# Altium schematic sheet MCU.SchDoc
size A3; SheetNumber: 2; SheetTotal: 10
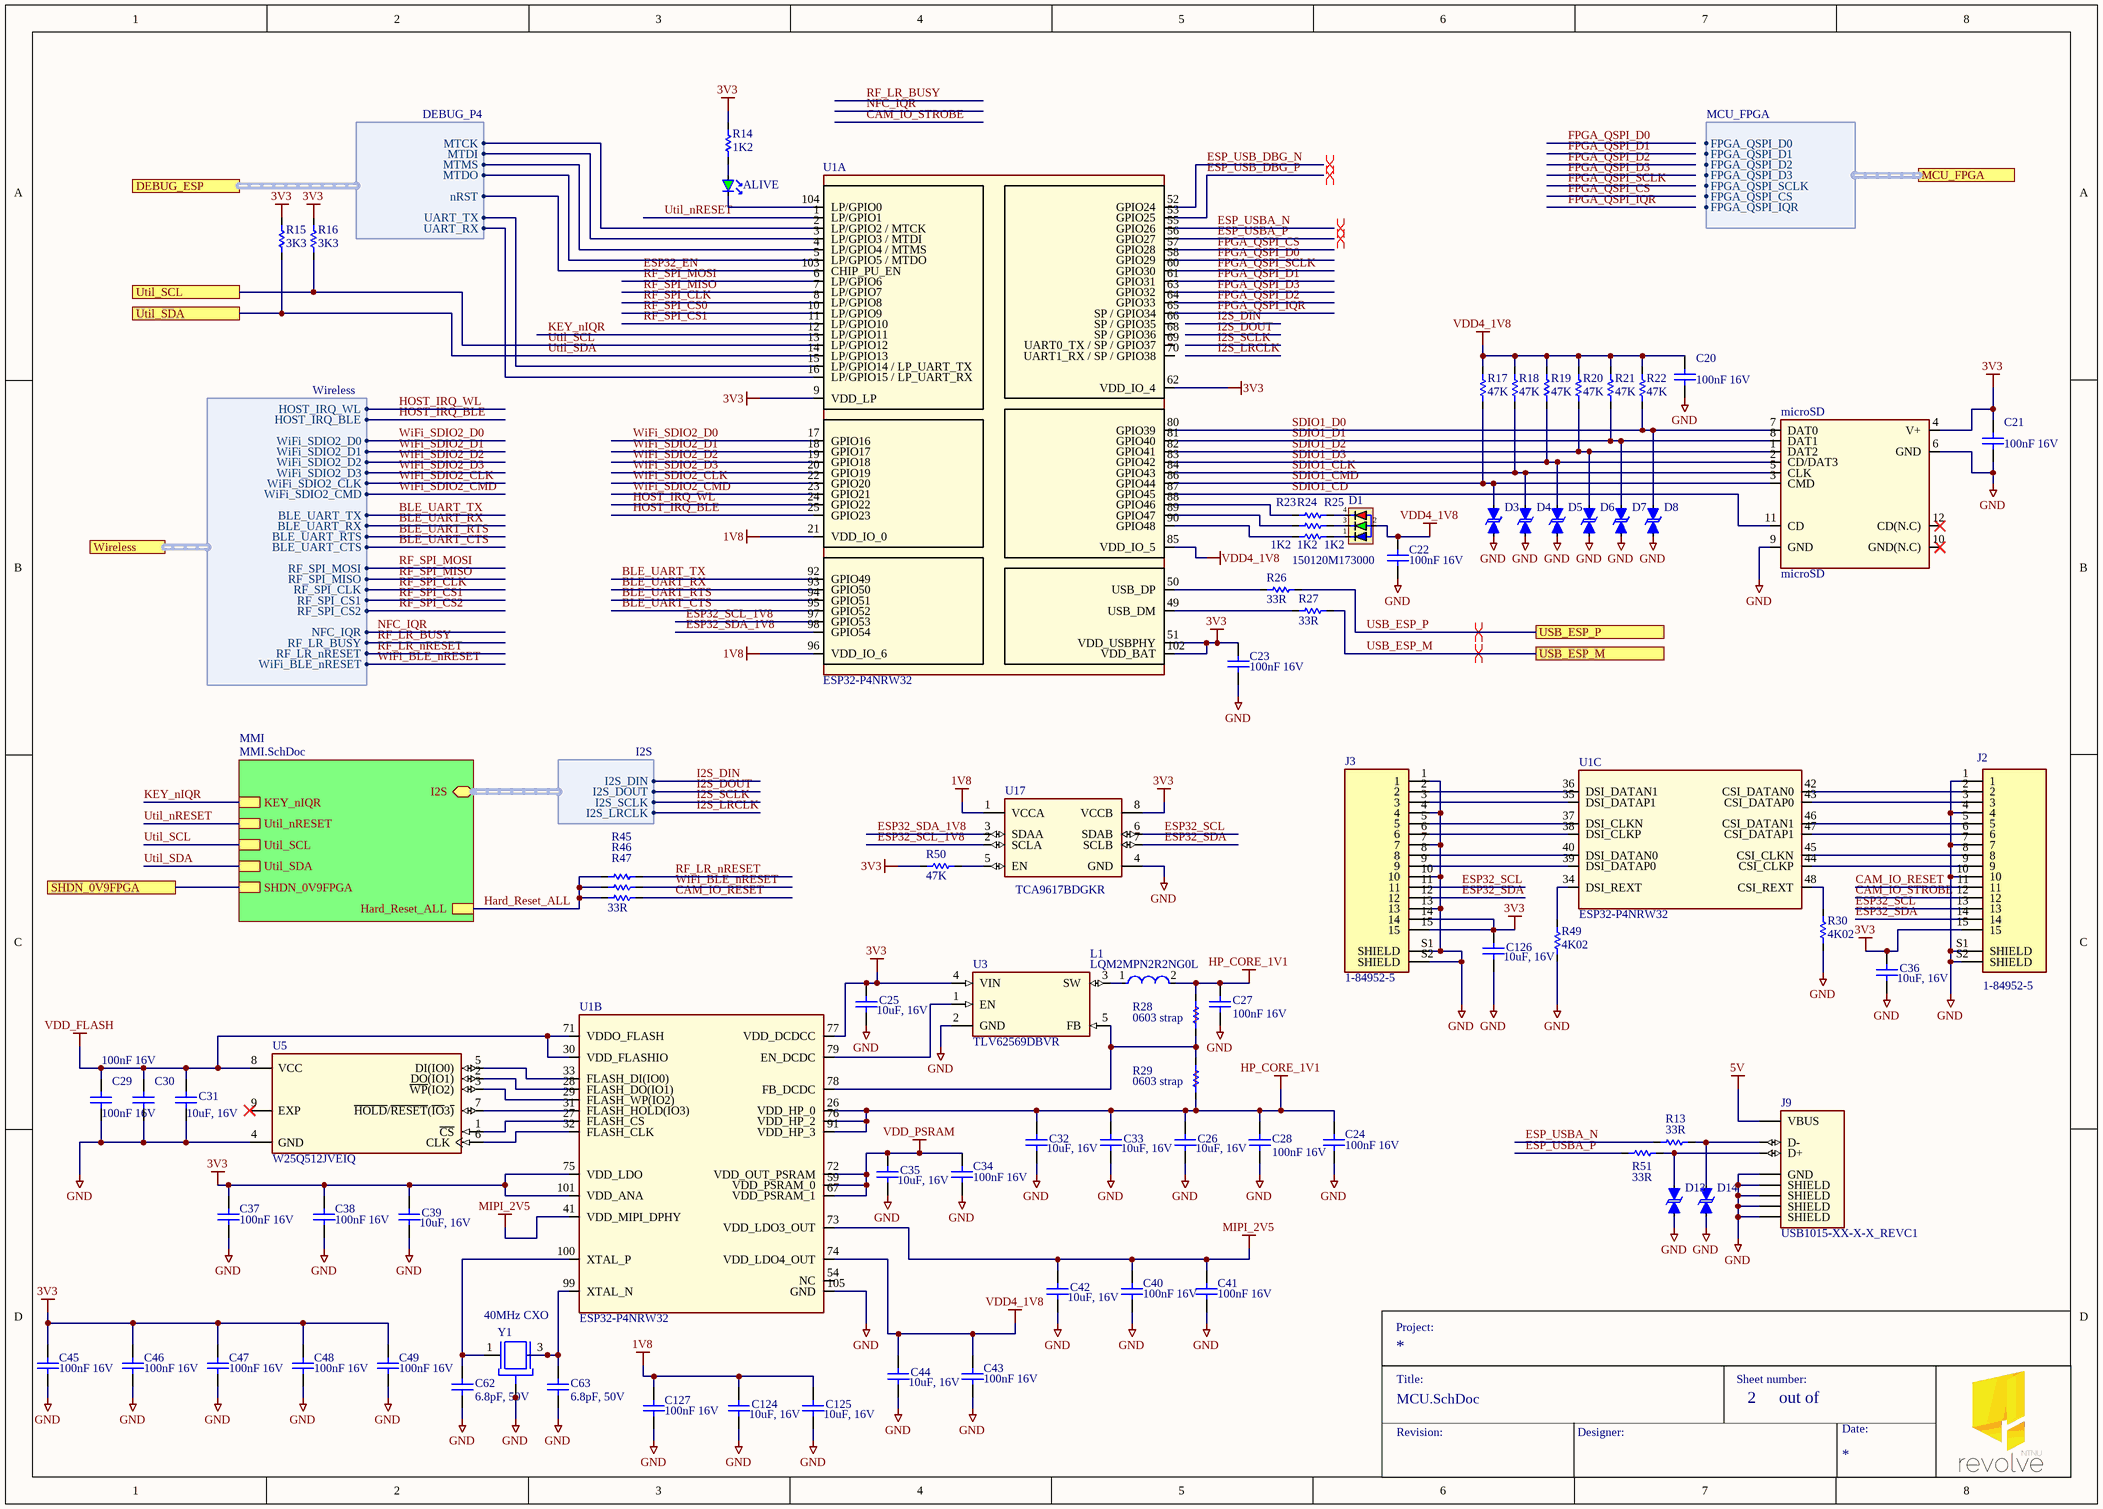
[diagram p0: MCU.SchDoc]

## Parts
ALIVE  SMD LED 0603, Green  [LED-0603-RED]  (value not drawn)
C20  100nF 16V  [0402]
C21  100nF 16V  [0402]
C22  100nF 16V  [0402]
C23  100nF 16V  [0402]
C24  100nF 16V  [0402]
C25  10uF, 16V  [0603 Capacitor]
C26  10uF, 16V  [0603 Capacitor]
C27  100nF 16V  [0402]
C28  100nF 16V  [0402]
C29  100nF 16V  [0402]
C30  100nF 16V  [0402]
C31  10uF, 16V  [0603 Capacitor]
C32  10uF, 16V  [0603 Capacitor]
C33  10uF, 16V  [0603 Capacitor]
C34  100nF 16V  [0402]
C35  10uF, 16V  [0603 Capacitor]
C36  10uF, 16V  [0603 Capacitor]
C37  100nF 16V  [0402]
C38  100nF 16V  [0402]
C39  10uF, 16V  [0603 Capacitor]
C40  100nF 16V  [0402]
C41  100nF 16V  [0402]
C42  10uF, 16V  [0603 Capacitor]
C43  100nF 16V  [0402]
C44  10uF, 16V  [0603 Capacitor]
C45  100nF 16V  [0402]
C46  100nF 16V  [0402]
C47  100nF 16V  [0402]
C48  100nF 16V  [0402]
C49  100nF 16V  [0402]
C62  6.8pF, 50V  [0402 resistor]
C63  6.8pF, 50V  [0402 resistor]
C124  10uF, 16V  [0603 Capacitor]
C125  10uF, 16V  [0603 Capacitor]
C126  10uF, 16V  [0603 Capacitor]
C127  100nF 16V  [0402]
D1  150120M173000  [WL-SFCW_1206]
D3  DESD3V3E1BL-7B  [CR_X1-DFN1006-2_DIO-M]  (value not drawn)
D4  DESD3V3E1BL-7B  [CR_X1-DFN1006-2_DIO-M]  (value not drawn)
D5  DESD3V3E1BL-7B  [CR_X1-DFN1006-2_DIO-M]  (value not drawn)
D6  DESD3V3E1BL-7B  [CR_X1-DFN1006-2_DIO-M]  (value not drawn)
D7  DESD3V3E1BL-7B  [CR_X1-DFN1006-2_DIO-M]  (value not drawn)
D8  DESD3V3E1BL-7B  [CR_X1-DFN1006-2_DIO-M]  (value not drawn)
D13  DESD3V3E1BL-7B  [CR_X1-DFN1006-2_DIO-M]  (value not drawn)
D14  DESD3V3E1BL-7B  [CR_X1-DFN1006-2_DIO-M]  (value not drawn)
J2  1-84952-5  [TE_1-84952-5]
J3  1-84952-5  [TE_1-84952-5]
J9  USB1015-XX-X-X_REVC1  [GCT_USB1015-XX-X-X_REVC1]
L1  LQM2MPN2R2NG0L  [FP-LQM2MPN_G0-IPC_B]
microSD  microSD  [microSD]
R13  33R  [0603 Resistor]
R14  1K2  [0603 Resistor]
R15  3K3  [0603 Resistor]
R16  3K3  [0603 Resistor]
R17  47K  [0603 Resistor]
R18  47K  [0603 Resistor]
R19  47K  [0603 Resistor]
R20  47K  [0603 Resistor]
R21  47K  [0603 Resistor]
R22  47K  [0603 Resistor]
R23  1K2  [0603 Resistor]
R24  1K2  [0603 Resistor]
R25  1K2  [0603 Resistor]
R26  33R  [0603 Resistor]
R27  33R  [0603 Resistor]
R28  0603 strap  [0603 pads]
R29  0603 strap  [0603 pads]
R30  4K02  [0603 Resistor]
R45  33R  [0603 Resistor]  (value not drawn)
R46  33R  [0603 Resistor]  (value not drawn)
R47  33R  [0603 Resistor]
R49  4K02  [0603 Resistor]
R50  47K  [0603 Resistor]
R51  33R  [0603 Resistor]
U1  ESP32-P4NRW32  [QFN35P1000X1000X85_HS-105M]  (parts A,B,C of 3)
U3  TLV62569DBVR  [SOT95P280X145-5N]
U5  W25Q512JVEIQ  [SON127P600X800X80-9N]
U17  TCA9617BDGKR  [SOP65P490X110-8N]
Y1  40MHz CXO  [XTAL_ECS-400-10-37B2-CKM-TR]

## Sub-sheets
MMI = MMI.SchDoc: KEY_nIQR, Util_nRESET, Util_SCL, Util_SDA, SHDN_0V9FPGA, Hard_Reset_ALL, I2S (bidir, harness I2S)

## Ports
DEBUG_ESP (harness DEBUG_P4), MCU_FPGA (harness MCU_FPGA), SHDN_0V9FPGA, USB_ESP_M, USB_ESP_P, Util_SCL, Util_SDA, Wireless (harness Wireless)

## Harnesses
DEBUG_P4: MTCK, MTDI, nRST, UART_TX, UART_RX, MTMS, MTDO
Wireless: WiFi_SDIO2_D0, WiFi_SDIO2_D1, WiFi_SDIO2_D2, WiFi_SDIO2_D3, WiFi_SDIO2_CLK, WiFi_SDIO2_CMD, BLE_UART_TX, BLE_UART_RX, RF_SPI_MOSI, RF_SPI_CLK, RF_SPI_MISO, RF_SPI_CS1, RF_SPI_CS2, BLE_UART_RTS, BLE_UART_CTS, HOST_IRQ_WL, HOST_IRQ_BLE, NFC_IQR, RF_LR_BUSY, RF_LR_nRESET, WiFi_BLE_nRESET
MCU_FPGA: FPGA_QSPI_D0, FPGA_QSPI_D1, FPGA_QSPI_D2, FPGA_QSPI_D3, FPGA_QSPI_SCLK, FPGA_QSPI_CS, FPGA_QSPI_IQR
I2S: I2S_DIN, I2S_DOUT, I2S_SCLK, I2S_LRCLK

## Nets
1V8: C124.2 C125.2 C127.2 U1.21(VDD_IO_0) U1.96(VDD_IO_6) U17.1(VCCA)
3V3: C21.2 C23.2 C25.2 C36.2 C37.2 C38.2 C39.2 C45.2 C46.2 C47.2 C48.2 C49.2 C126.2 J2.15 J3.14 J3.15 microSD.4(V+) R14.2 R15.2 R16.2 R50.1 U1.9(VDD_LP) U1.51(VDD_USBPHY) U1.62(VDD_IO_4) U1.75(VDD_LDO) U1.77(VDD_DCDCC) U1.101(VDD_ANA) U1.102(VDD_BAT) U3.4(VIN) U17.8(VCCB)
5V: J9.1(VBUS)
GND: C20.1 C21.1 C22.1 C23.1 C24.1 C25.1 C26.1 C27.2 C28.2 C29.1 C30.1 C31.1 C32.1 C33.1 C34.1 C35.1 C36.1 C37.1 C38.1 C39.1 C40.1 C41.1 C42.1 C43.1 C44.1 C45.1 C46.1 C47.1 C48.1 C49.1 C62.1 C63.1 C124.1 C125.1 C126.1 C127.1 D3.2(ANODE) D4.2(ANODE) D5.2(ANODE) D6.2(ANODE) D7.2(ANODE) D8.2(ANODE) D13.2(ANODE) D14.2(ANODE) J2.1 J2.4 J2.7 J2.10 J2.S1(SHIELD) J2.S2(SHIELD) J3.1 J3.4 J3.7 J3.10 J3.13 J3.S1(SHIELD) J3.S2(SHIELD) J9.4(GND) J9.SH1(SHIELD) J9.SH2(SHIELD) J9.SH3(SHIELD) J9.SH4(SHIELD) microSD.6(GND) microSD.9(GND) R30.1 R49.1 U1.105(GND) U3.2(GND) U5.4(GND) U17.4(GND) Y1.2(GND) Y1.4(GND)
HP_CORE_1V1: C24.2 C26.2 C27.1 C28.1 C32.2 C33.2 L1.2 R28.2 R29.1 U1.26(VDD_HP_0) U1.76(VDD_HP_2) U1.91(VDD_HP_3)
MIPI_2V5: C40.2 C41.2 C42.2 U1.41(VDD_MIPI_DPHY) U1.73(VDD_LDO3_OUT)
VDD4_1V8: C20.2 C22.2 C43.2 C44.2 D1.2(Anode) R17.1 R18.1 R19.1 R20.1 R21.1 R22.1 U1.74(VDD_LDO4_OUT) U1.85(VDD_IO_5)
VDD_FLASH: C29.2 C30.2 C31.2 U1.30(VDD_FLASHIO) U1.71(VDDO_FLASH) U5.8(VCC)
VDD_PSRAM: C34.2 C35.2 U1.59(VDD_PSRAM_0) U1.67(VDD_PSRAM_1) U1.72(VDD_OUT_PSRAM)
BLE_UART_CTS: U1.95(GPIO52) ; port Wireless.BLE_UART_CTS
BLE_UART_RTS: U1.94(GPIO51) ; port Wireless.BLE_UART_RTS
BLE_UART_RX: U1.93(GPIO50) ; port Wireless.BLE_UART_RX
BLE_UART_TX: U1.92(GPIO49) ; port Wireless.BLE_UART_TX
CAM_IO_RESET: J2.11 R47.2
CAM_IO_STROBE: J2.12
ESP32_EN: U1.103(CHIP_PU_EN) ; port DEBUG_ESP.nRST
ESP32_SCL: J2.13 J3.11 U17.6(SDAB)
ESP32_SCL_1V8: U1.97(GPIO53) U17.2(SCLA)
ESP32_SDA: J2.14 J3.12 U17.7(SCLB)
ESP32_SDA_1V8: U1.98(GPIO54) U17.3(SDAA)
ESP_USB_DBG_N: U1.52(GPIO24)
ESP_USB_DBG_P: U1.53(GPIO25)
ESP_USBA_N: R13.1 U1.55(GPIO26)
ESP_USBA_P: R51.1 U1.56(GPIO27)
FPGA_QSPI_CS: U1.57(GPIO28)
FPGA_QSPI_D0: U1.58(GPIO29)
FPGA_QSPI_D1: U1.61(GPIO31)
FPGA_QSPI_D2: U1.64(GPIO33)
FPGA_QSPI_D3: U1.63(GPIO32)
FPGA_QSPI_IQR: U1.65(SP_/_GPIO34)
FPGA_QSPI_SCLK: U1.60(GPIO30)
Hard_Reset_ALL: R45.1 R46.1 R47.1 ; sheet MMI/Hard_Reset_ALL
HOST_IRQ_BLE: U1.25(GPIO23) ; port Wireless.HOST_IRQ_BLE
HOST_IRQ_WL: U1.24(GPIO22) ; port Wireless.HOST_IRQ_WL
I2S_DIN: sheet MMI/I2S.I2S_DIN
I2S_DOUT: sheet MMI/I2S.I2S_DOUT
I2S_LRCLK: sheet MMI/I2S.I2S_LRCLK
I2S_SCLK: sheet MMI/I2S.I2S_SCLK
KEY_nIQR: U1.12(LP/GPIO11) ; sheet MMI/KEY_nIQR
NFC_IQR: port Wireless.NFC_IQR
RF_LR_BUSY: port Wireless.RF_LR_BUSY
RF_LR_nRESET: R45.2 ; port Wireless.RF_LR_nRESET
RF_SPI_CLK: U1.8(LP/GPIO8) ; port Wireless.RF_SPI_CLK
RF_SPI_CS0: U1.10(LP/GPIO9)
RF_SPI_CS1: U1.11(LP/GPIO10) ; port Wireless.RF_SPI_CS1
RF_SPI_CS2: port Wireless.RF_SPI_CS2
RF_SPI_MISO: U1.7(LP/GPIO7) ; port Wireless.RF_SPI_MISO
RF_SPI_MOSI: U1.6(LP/GPIO6) ; port Wireless.RF_SPI_MOSI
SDIO1_CD: microSD.11(CD) U1.87(GPIO45)
SDIO1_CLK: D4.1(CATHODE) microSD.5(CLK) R18.2 U1.84(GPIO43)
SDIO1_CMD: D3.1(CATHODE) microSD.3(CMD) R17.2 U1.86(GPIO44)
SDIO1_D0: D8.1(CATHODE) microSD.7(DAT0) R22.2 U1.80(GPIO39)
SDIO1_D1: D7.1(CATHODE) microSD.8(DAT1) R21.2 U1.81(GPIO40)
SDIO1_D2: D6.1(CATHODE) microSD.1(DAT2) R20.2 U1.82(GPIO41)
SDIO1_D3: D5.1(CATHODE) microSD.2(CD/DAT3) R19.2 U1.83(GPIO42)
SHDN_0V9FPGA: port SHDN_0V9FPGA, sheet MMI/SHDN_0V9FPGA
USB_ESP_M: R27.2 ; port USB_ESP_M
USB_ESP_P: R26.2 ; port USB_ESP_P
Util_nRESET: U1.1(LP/GPIO1) ; sheet MMI/Util_nRESET
Util_SCL: R16.1 U1.13(LP/GPIO12) ; port Util_SCL, sheet MMI/Util_SCL
Util_SDA: R15.1 U1.14(LP/GPIO13) ; port Util_SDA, sheet MMI/Util_SDA
WiFi_BLE_nRESET: R46.2 ; port Wireless.WiFi_BLE_nRESET
WiFi_SDIO2_CLK: U1.22(GPIO20) ; port Wireless.WiFi_SDIO2_CLK
WiFi_SDIO2_CMD: U1.23(GPIO21) ; port Wireless.WiFi_SDIO2_CMD
WiFi_SDIO2_D0: U1.17(GPIO16) ; port Wireless.WiFi_SDIO2_D0
WiFi_SDIO2_D1: U1.18(GPIO17) ; port Wireless.WiFi_SDIO2_D1
WiFi_SDIO2_D2: U1.19(GPIO18) ; port Wireless.WiFi_SDIO2_D2
WiFi_SDIO2_D3: U1.20(GPIO19) ; port Wireless.WiFi_SDIO2_D3
NetALIVE_1: ALIVE.1(A) R14.1
NetALIVE_2: ALIVE.2(K) U1.104(LP/GPIO0)
NetC62_2: C62.2 U1.100(XTAL_P) Y1.1(IN/OUT)
NetC63_2: C63.2 U1.99(XTAL_N) Y1.3(OUT/IN)
NetD1_1: D1.1 R25.2
NetD1_3: D1.3 R24.2
NetD1_4: D1.4 R23.2
NetD13_1: D13.1(CATHODE) J9.3(D+) R51.2
NetD14_1: D14.1(CATHODE) J9.2(D-) R13.2
NetJ2_2: J2.2 U1.42(CSI_DATAN0)
NetJ2_3: J2.3 U1.43(CSI_DATAP0)
NetJ2_5: J2.5 U1.46(CSI_DATAN1)
NetJ2_6: J2.6 U1.47(CSI_DATAP1)
NetJ2_8: J2.8 U1.45(CSI_CLKN)
NetJ2_9: J2.9 U1.44(CSI_CLKP)
NetJ3_2: J3.2 U1.36(DSI_DATAN1)
NetJ3_3: J3.3 U1.35(DSI_DATAP1)
NetJ3_5: J3.5 U1.37(DSI_CLKN)
NetJ3_6: J3.6 U1.38(DSI_CLKP)
NetJ3_8: J3.8 U1.40(DSI_DATAN0)
NetJ3_9: J3.9 U1.39(DSI_DATAP0)
NetL1_1: L1.1 U3.3(SW)
NetR23_1: R23.1 U1.88(GPIO46)
NetR24_1: R24.1 U1.89(GPIO47)
NetR25_1: R25.1 U1.90(GPIO48)
NetR26_1: R26.1 U1.50(USB_DP)
NetR27_1: R27.1 U1.49(USB_DM)
NetR28_1: R28.1 R29.2 U1.78(FB_DCDC) U3.5(FB)
NetR30_2: R30.2 U1.48(CSI_REXT)
NetR49_2: R49.2 U1.34(DSI_REXT)
NetR50_2: R50.2 U17.5(EN)
NetU1_2: U1.2(LP/GPIO2_/_MTCK) ; port DEBUG_ESP.MTCK
NetU1_3: U1.3(LP/GPIO3_/_MTDI) ; port DEBUG_ESP.MTDI
NetU1_4: U1.4(LP/GPIO4_/_MTMS) ; port DEBUG_ESP.MTMS
NetU1_5: U1.5(LP/GPIO5_/_MTDO) ; port DEBUG_ESP.MTDO
NetU1_15: U1.15(LP/GPIO14_/_LP_UART_TX) ; port DEBUG_ESP.UART_TX
NetU1_16: U1.16(LP/GPIO15_/_LP_UART_RX) ; port DEBUG_ESP.UART_RX
NetU1_27: U1.27(FLASH_CS) U5.1(~{CS})
NetU1_28: U1.28(FLASH_DO(IO1)) U5.2(DO(IO1))
NetU1_29: U1.29(FLASH_WP(IO2)) U5.3(~{WP}(IO2))
NetU1_31: U1.31(FLASH_HOLD(IO3)) U5.7(~{HOLD}/~{RESET}(~{IO}3~{)})
NetU1_32: U1.32(FLASH_CLK) U5.6(CLK)
NetU1_33: U1.33(FLASH_DI(IO0)) U5.5(DI(IO0))
NetU1_79: U1.79(EN_DCDC) U3.1(EN)

Not connected (* = marked no-connect by the designer): microSD 10(GND(N.C))* 12(CD(N.C))*; U1 54(NC) 66(SP_/_GPIO35) 68(SP_/_GPIO36) 69(UART0_TX_/_SP_/_GPIO37) 70(UART1_RX_/_SP_/_GPIO38); U5 9(EXP)*

## Layout directives
differential pair: ESP_USB_DBG_N, ESP_USB_DBG_P, ESP_USBA_N, ESP_USBA_P, USB_ESP_M, USB_ESP_P

## Notes on the sheet
- Project:
- Title:
- Sheet number:
- Revision:
- Designer:
- out of
- Date:

## Library data of the parts
ALIVE = CMP-004-00003-1: 0603LED-Green; Component Type: Standard; Design Item ID: CMP-001-C10-9; Source: Components - 10.10.25 - 00.17.SchLib; Pin Count: 2
C20-C24 C27-C30 C34 C37 C38 C40 C41 C43 C45-C49 C127 = CMP-00017-A.2
C25 C26 C31-C33 C35 C36 C39 C42 C44 C124-C126 = CMP-001-B36-7: 10uF, 16V, 20%, X5R, 0603; value: 10uF
C62 C63 = CMP-00397-1: 6.8pF, 50V, 10%, 0402; Voltage Rating (DC): 50V; Value: 6.8pF
D1 = CMP-004-00000-1: Led, Red/Green/Blue, 360Mcd/1Cd/350Mcd Rohs Compliant: Yes; Max Reverse Voltage (DC): 5V; Viewing Angle: 120°; Forward Current: 100mA; Luminous Intensity: 350mcd; Dominant Wavelength: 525nm; Forward Voltage: 2V; Power Dissipation: 65mW; Peak Wavelength: 468nm; Max Operating Temperature: 85°C; Width: 1.6mm; Length: 3.2mm; Height: 700µm; RoHS: Compliant; Min Operating Temperature: -40°C
D3-D8 D13 D14 = DESD3V3E1BL-7B: TVS DIODE 3.3V, DFN1006-2, 13pF @ 1MHz; Manufacturer_Name: Diodes Inc; Copyright: Copyright (C) 2025 Ultra Librarian. All rights reserved.; Manufacturer_Part_Number: DESD3V3E1BL-7B; RefDes: RefDes; Type: Type
J2 J3 = 1-84952-5: Conn FPC Connector SKT 15 POS 1mm Solder RA SMD T/R; MF: TE Connectivity; Value: *; SnapEDA_Link: https://www.snapeda.com/parts/1-84952-5/TE+Connectivity+AMP+Connectors/view-part/?ref=snap; Purchase-URL: https://pricing.snapeda.com/search/part/1-84952-5/?ref=eda; EU_RoHS_Compliance: Compliant; Availability: In Stock; Price: None; Package: None; Check_prices: https://www.snapeda.com/parts/1-84952-5/TE+Connectivity+AMP+Connectors/view-part/?ref=eda; MP: 1-84952-5
J9 = USB1015-XX-X-X_REVC1: USB-A (USB TYPE-A) USB 2.0 Receptacle Connector 4 Position Board Edge, Cutout; Through Hole, Right Angle; MF: Global Connector Technology; MP: USB1015-GF-L-A; SnapEDA_Link: https://www.snapeda.com/parts/USB1015-GF-L-A/Global+Connector+Technology/view-part/?ref=snap; Package: None; Value: *; Check_prices: https://www.snapeda.com/parts/USB1015-GF-L-A/Global+Connector+Technology/view-part/?ref=eda
L1 = CMP-006-00001-1: Inductor Power Chip Shielded Multi-Layer 2.2uH 30% 1MHz Ferrite 1.2A 0.138Ohm DCR 0806 T/R; Manufacturer Lifecycle Status: IN PRODUCTION; Value: 138mΩ; Shielding: Yes; Self Resonant Frequency: 40MHz; Number of Circuits: 1; Depth: 1.75mm; Max Operating Temperature: 125°C; DC Current: 1.2A; Schedule B: 8504500000, 8504500000; Test Frequency: 1MHz; Current Rating: 1.2A; Case Code (Imperial): 0806; Packaging: Cut Tape; Military Standard: Not; Height: 900µm; Max Current Rating: 1.2A; Lead Free: Lead Free; Tolerance: 30%; REACH SVHC: Yes; Min Operating Temperature: -55°C; Radiation Hardening: No; Number of Terminals: 2; ESR: 138mΩ; Width: 1.6mm; Inductance Tolerance: 30%; Lifecycle Status: Production; Height - Seated (Max): 990.6µm; Case Code (Metric): 2016; Case/Package: 0806; Max DC Current: 1.2A; Core Material: Ferrite; Termination: SMD/SMT; RoHS: Compliant; Mounting Technology: Surface Mount; RMS Current (Irms): 1.2A; DC Resistance (DCR): 138mΩ; Length: 2.0066mm
microSD = microSD: wurth µSD connector
R13 R26 R27 R45-R47 R51 = CMP-001-C30-7: 33R, 1%, 1/10W, 0603; Manufacturer: Panasonic; Manufacturer Part Number: ERJ-3EKF33R0V; Temperature Coefficient: 100ppm/°C; Max Power Dissipation: 100mW; Voltage Rating: 75V; REACH SVHC: No SVHC; Resistance: 33R; Composition: Thick Film; Tolerance: 1%; Lead Free: Lead Free; Contact Plating: Tin; Package Quantity: 1; Number of Terminations: 2; Number of Pins: 2; Case Code (Metric): 1608; Width: 0.031inch; Min Operating Temperature: -55°C; Military Standard: Not; Termination: SMD/SMT; Radiation Hardening: No; Case Code (Imperial): 0603; Mount: Surface Mount; Depth: 0.8mm; Max Operating Temperature: 155°C; Voltage Rating (DC): 75V; Features: Automotive AEC-Q200; Power Rating: 100mW; Packaging: Tape and Reel; Supplier Part Number: P33.0HCT-ND; Length: 1.6mm; Supplier: Digi-Key; Height: 0.022inch; Case/Package: 0603
R14 R23-R25 = CMP-001-B03-6: 1K2, 5%, 1/10W, 0603
R15 R16 = CMP-001-G92-A.2: 3K3, 5%, 1/10W, 0603
R17-R22 R50 = CMP-001-B87-6: 47K, 1%, 1/10W, 0603
R28 R29 = CMP-001-E44-4: No resistor, just the pad
R30 R49 = CMP-001-R11-1: 4K02, 1%, 1/10W, 0603
U1 = ESP32-P4NRW32-R09.0.1: RISC-V 32-bit dual-core 360MHz,  32MB PSRAM, 55xGPIO
U3 = TLV62569DBVR: 2.5V-5.5V input, 2-A high efficiency step-down buck converter in SOT23 and SOT563 package; MF: Texas Instruments; SnapEDA_Link: https://www.snapeda.com/parts/TLV62569DBVR/Texas+Instruments/view-part/?ref=snap; Package: SOT-23-5 Texas Instruments; Value: *; MP: TLV62569DBVR; Check_prices: https://www.snapeda.com/parts/TLV62569DBVR/Texas+Instruments/view-part/?ref=eda; Supplier 1: DigiKey; Supplier Part Number 1: 296-47360-1-ND; Supplier 2: Mouser; Supplier Part Number 2: 445-SY20018IAAC
U5 = W25Q512JVEIQ: FLASH - NOR Memory IC 512Mb (64M x 8) SPI - Quad I/O 133 MHz 8-WSON (8x6); MF: Winbond Electronics; SnapEDA_Link: https://www.snapeda.com/parts/W25Q512JVEIQ/Winbond/view-part/?ref=snap; Package: Package; Value: *; MP: W25Q512JVEIQ; Check_prices: https://www.snapeda.com/parts/W25Q512JVEIQ/Winbond/view-part/?ref=eda; Supplier 1: DigiKey; Supplier Part Number 1: 256-W25Q512JVEIQ-TUBE-ND
U17 = TCA9617BDGKR: 2-bit level-translating 1-MHz I2C/SMBus buffer/repeater with powered-off high-impedance; MF: Texas Instruments; SnapEDA_Link: https://www.snapeda.com/parts/TCA9617BDGKR/Texas+Instruments/view-part/?ref=snap; Package: VSSOP-8 Texas Instruments; Value: *; MP: TCA9617BDGKR; Check_prices: https://www.snapeda.com/parts/TCA9617BDGKR/Texas+Instruments/view-part/?ref=eda; Supplier 1: Arrow Electronics; Supplier Part Number 1: TCA9617BDGKR
Y1 = ECS-400-10-37B2-CKM-TR: Crystal 40MHz ±10ppm (Tol) ±10ppm (Stability) 10pF FUND 40Ohm 4-Pin Mini-CSMD T/R; MF: ECS Inc.; SnapEDA_Link: https://www.snapeda.com/parts/ECS-400-10-37B2-CKM-TR/ECS+Inc./view-part/?ref=snap; Package: ECX-1637B-37B-4 ECS; Value: *; MP: ECS-400-10-37B2-CKM-TR; Check_prices: https://www.snapeda.com/parts/ECS-400-10-37B2-CKM-TR/ECS+Inc./view-part/?ref=eda